# EAGLE design Tx (EAGLE 8.1.1)
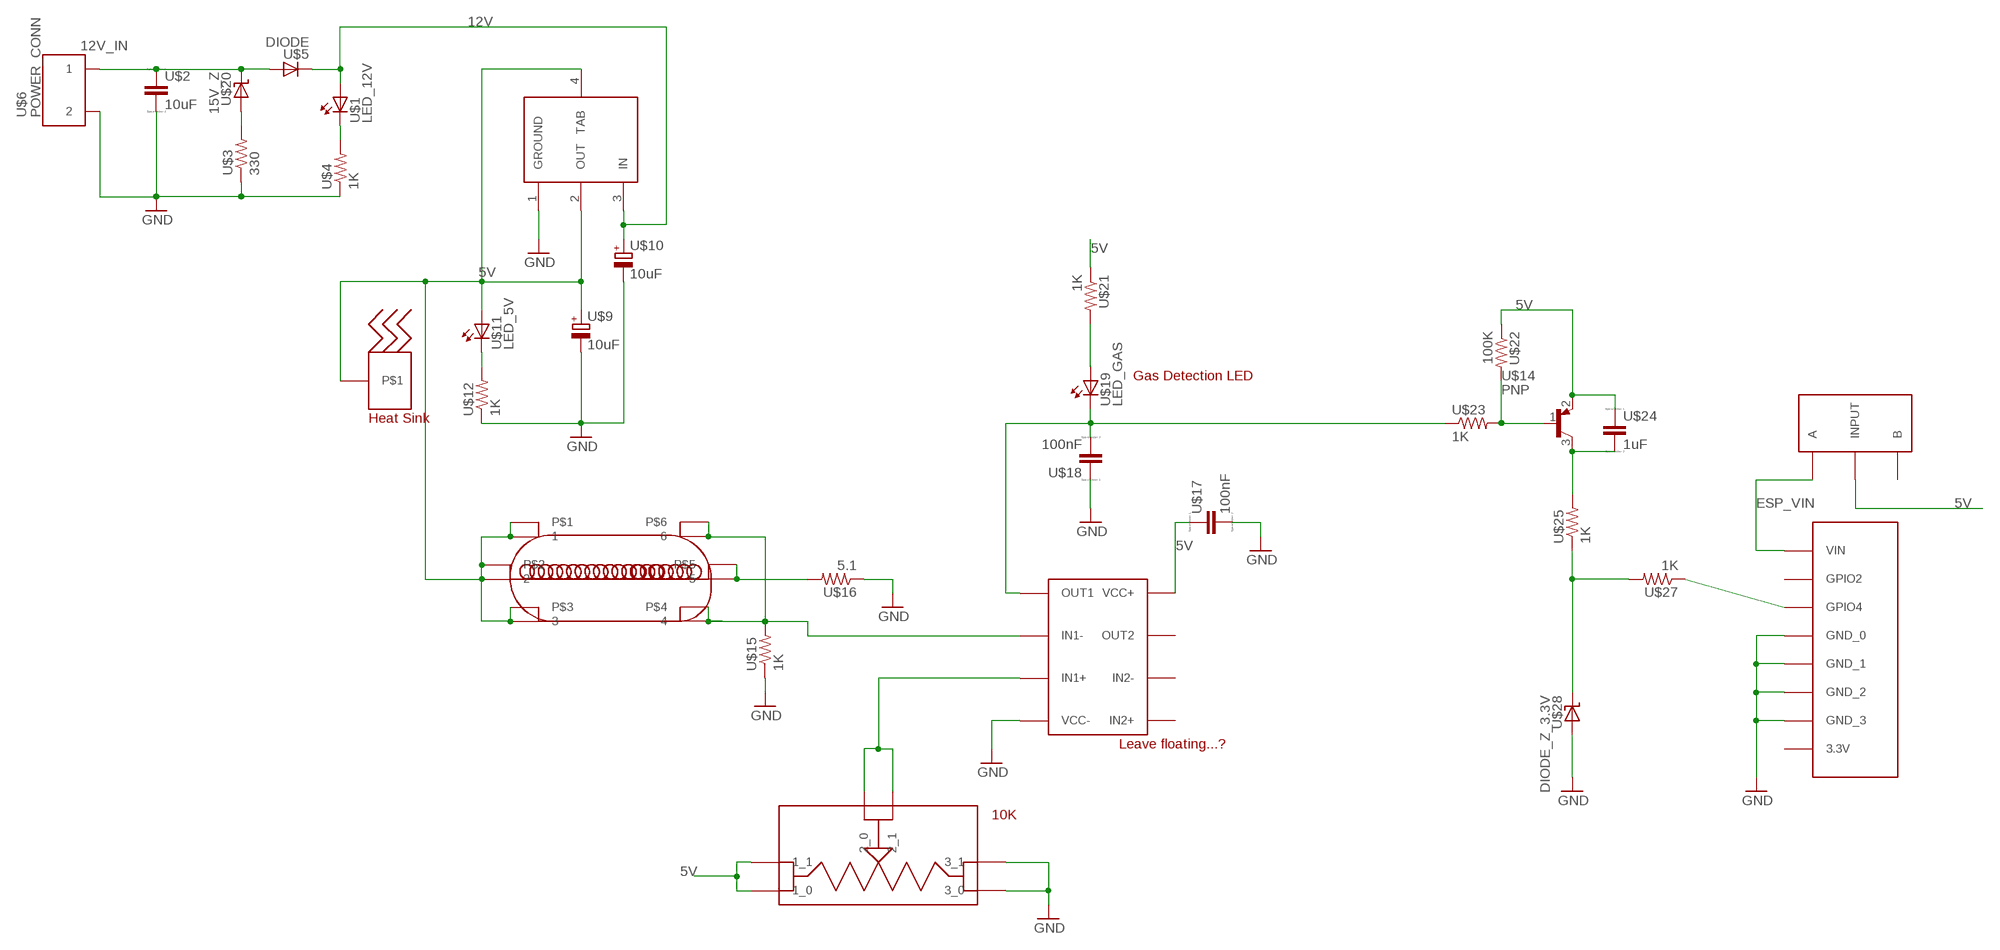
[diagram p0: schematic, sheet 1]

## Parts
U$1  LED_12V  LED_1206  [LED_1206]
U$2  10uF  CAP  [C1206]
U$3  330  RES  [R1206]
U$4  1K  RES  [R1206]
U$5  DIODE  DIODE_1206  [DIDOE_1206]
U$6  POWER_CONN  [PC_1935161]
U$7  LM393  [SO8]
U$8  5V_REG  [SOT223]
U$9  10uF  CAP_POL  [153CLV-0405]
U$10  10uF  CAP_POL  [153CLV-0405]
U$11  LED_5V  LED_1206  [LED_1206]
U$12  1K  RES  [R1206]
U$13  MQ  [MQ_GAS]
U$14  PNP  [SOT23]
U$15  1K  RES  [R1206]
U$16  5.1  RES  [R1206]
U$17  100nF  CAP  [C1206]
U$18  100nF  CAP  [C1206]
U$19  LED_GAS  LED_1206  [LED_1206]
U$20  15V_Z  DIODE_Z_1005  [Z_1005]
U$21  1K  RES  [R1206]
U$22  100K  RES  [R1206]
U$23  1K  RES  [R1206]
U$24  1uF  CAP  [C1206]
U$25  1K  RES  [R1206]
U$27  1K  RES  [R1206]
U$28  DIODE_Z_3.3V  [SOD-323]
U$29  ESP8266  [ESP]
U$30  POTENTIOMETER  [POTENTIOMETER]
U$31  HEAT_SINK  [THERMAL]
U$32  SPDT  [SPDT]

## Nets
5V: U$7.8(VCC+) U$8.2(OUT) U$8.4(TAB) U$9.+ U$11.1(HI) U$13.1 U$13.2 U$13.3 U$13.7 U$13.8 U$13.9 U$14.2(E) U$17.1 U$21.1 U$22.1 U$24.1 U$30.1_0 U$30.1_1 U$31.P$1 U$32.IN(INPUT)
12V: U$1.1(HI) U$5.2(LO) U$8.3(IN) U$10.+
12V_IN: U$2.1 U$5.1(HI) U$6.1 U$20.2(LO)
ESP_VIN: U$29.VIN U$32.A
GND: U$2.2 U$3.1 U$4.1 U$6.2 U$7.4(VCC-) U$8.1(GROUND) U$9.- U$10.- U$12.1 U$15.1 U$16.1 U$17.2 U$18.1 U$28.P$1(HI) U$29.GND_0 U$29.GND_1 U$29.GND_2 U$29.GND_3 U$30.3_0 U$30.3_1
N$2: U$1.2(LO) U$4.2
N$3: U$11.2(LO) U$12.2
N$4: U$13.5 U$13.11 U$16.2
N$5: U$3.2 U$20.1(HI)
N$6: U$7.3(IN1+) U$30.2_0 U$30.2_1
N$7: U$7.1(OUT1) U$18.2 U$19.2(LO) U$23.1
N$8: U$14.1(B) U$22.2 U$23.2
N$9: U$19.1(HI) U$21.2
N$11: U$14.3(C) U$24.2 U$25.2
N$13: U$25.1 U$27.2 U$28.P$2(LO)
N$14: U$27.1 U$29.GPIO4
N$15: U$7.2(IN1-) U$13.4 U$13.6 U$13.10 U$13.12 U$15.2
Unconnected: U$7.5(IN2+) U$7.6(IN2-) U$7.7(OUT2) U$29.3.3_1(3.3V) U$29.GPIO2 U$32.B

## Notes on the sheet
- Gas Detection LED
- Leave floating...?
- 10K

## Library data of the parts
U$1 U$11 U$19 = Gas_Sensor_Lib_v1:LED_1206
U$2 U$17 U$18 U$24 = Gas_Sensor_Lib_v1:CAP
U$3 U$4 U$12 U$15 U$16 U$21-U$23 U$25 U$27 = Gas_Sensor_Lib_v1:RES
U$5 = Gas_Sensor_Lib_v1:DIODE_1206
U$6 = Gas_Sensor_Lib_v1:POWER_CONN
U$7 = Gas_Sensor_Lib_v1:LM393
U$8 = Gas_Sensor_Lib_v1:5V_REG
U$9 U$10 = Gas_Sensor_Lib_v1:CAP_POL
U$13 = Gas_Sensor_Lib_v1:MQ
U$14 = Gas_Sensor_Lib_v1:PNP
U$20 = Gas_Sensor_Lib_v1:DIODE_Z_1005
U$28 = Gas_Sensor_Lib_v1:DIODE_Z_3.3V
U$29 = Gas_Sensor_Lib_v1:ESP8266
U$30 = Gas_Sensor_Lib_v1:POTENTIOMETER
U$31 = Gas_Sensor_Lib_v1:HEAT_SINK
U$32 = Gas_Sensor_Lib_v1:SPDT

## Board
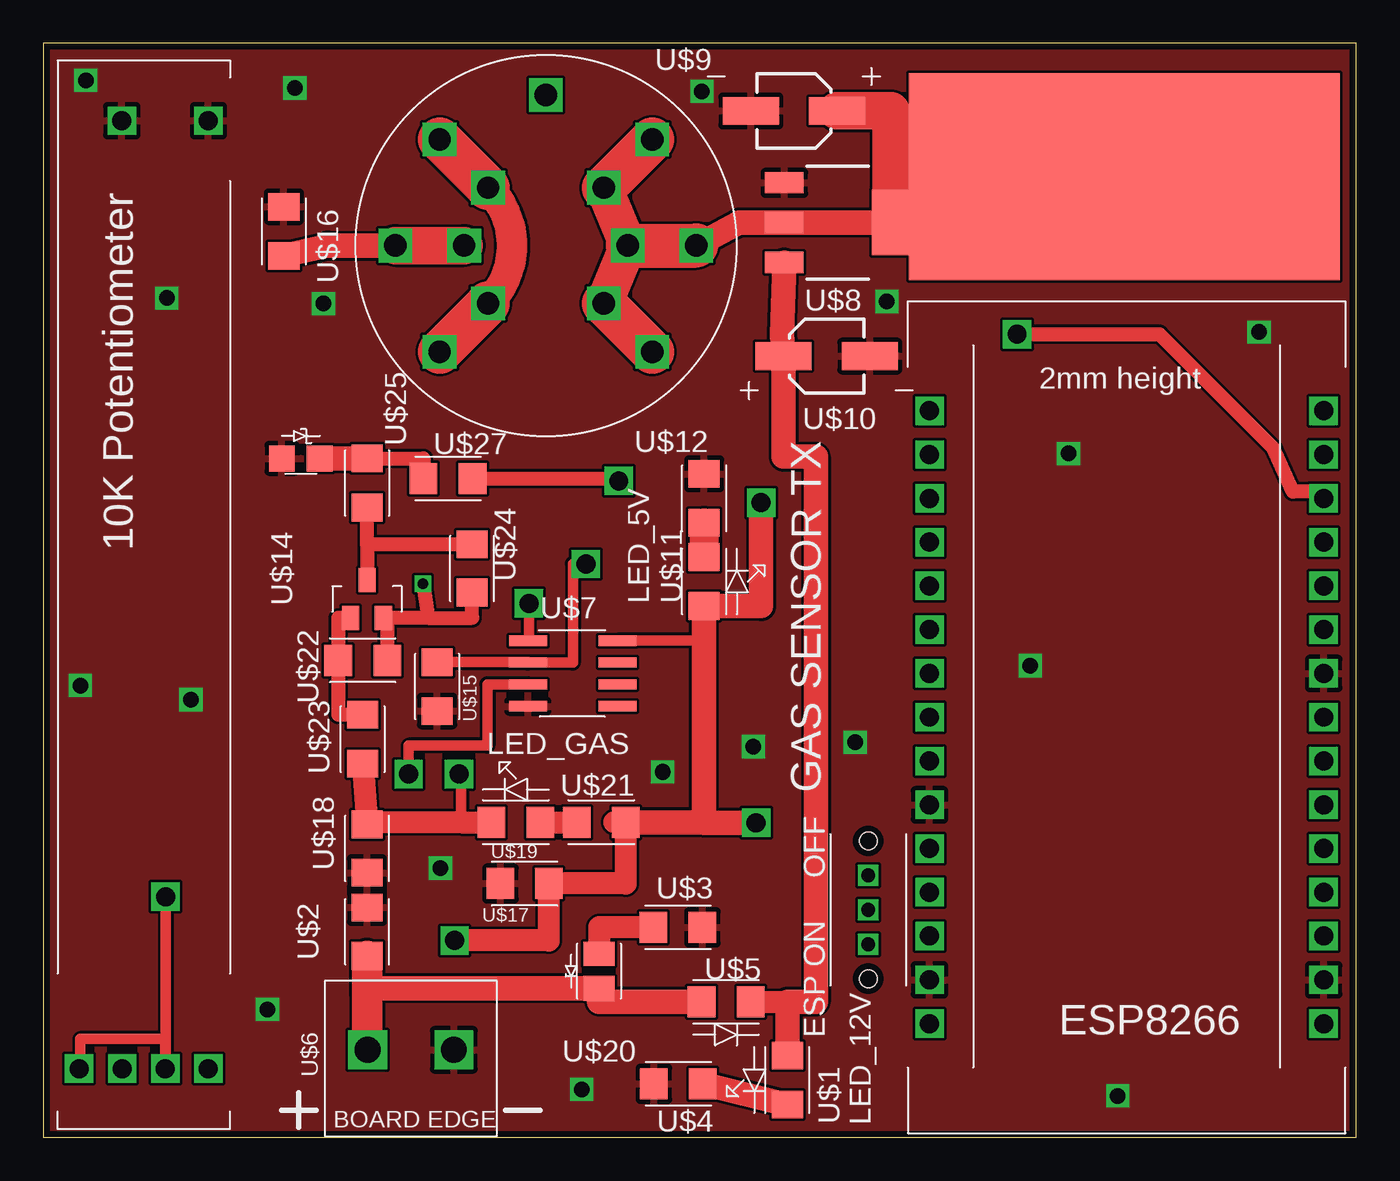
[diagram p1: board, top side]
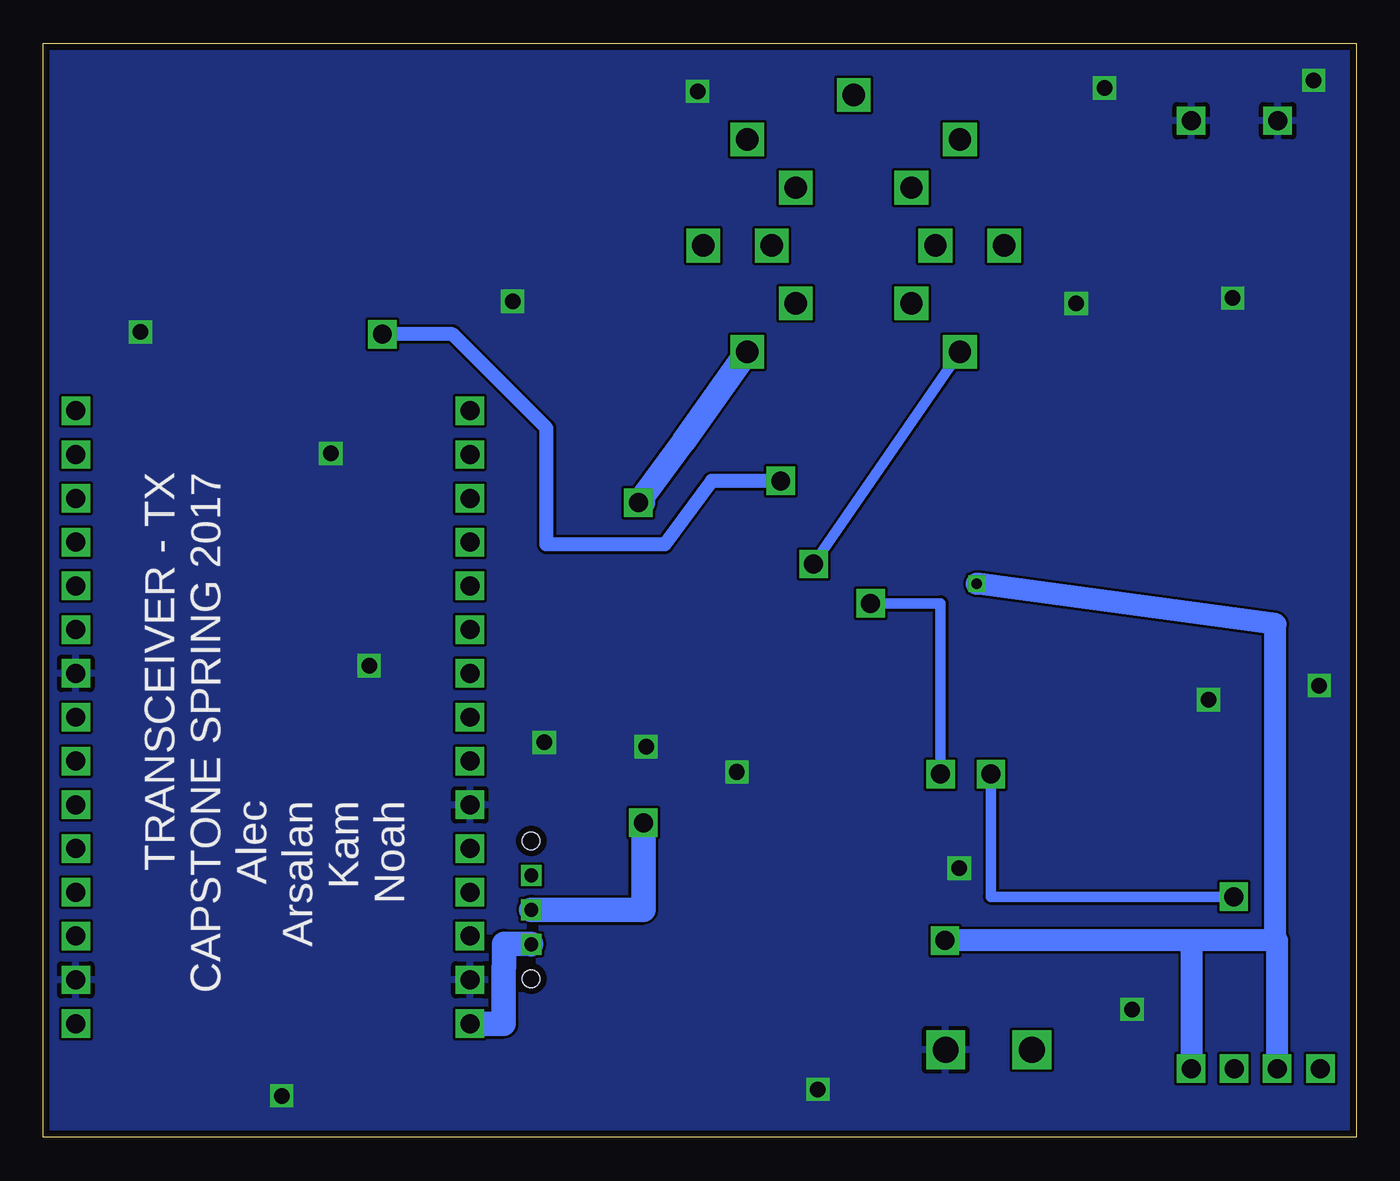
[diagram p2: board, bottom side, seen from below]

Size 76.2 x 63.5 mm. Coordinates in mm from the lower left corner, seen from the top.
Outline: 0,0 76.2,0 76.2,63.5 0,63.5 0,0
Copper layers (1*16): Top 0.0356mm / dielectric 1.5011mm / Bottom 0.0356mm
Design rules "oshpark-2layer": minimum track width 6mil, minimum drill 13mil, track to track 6mil, track to pad 6mil, pad to pad 6mil, via to via 6mil, smd to smd 6mil, copper to edge 15mil, drill to drill 6mil, minimum pad ring 7mil, minimum via ring 7mil, stop-mask expansion 2.5mil, vias tented up to drill 0mil, thermal gap 10mil

### Footprints (pad centres in the part's own frame; a part is rotated, then mirrored left to right if it is on the bottom)
LED_1206 = smd 1.6 x 1.803: 1 -1.422,0; 2 1.422,0
C1206 = smd 1.6 x 1.8: 1 -1.4,0; 2 1.4,0
R1206 = smd 1.6 x 1.803: 1 -1.422,0; 2 1.422,0
DIDOE_1206 = smd 1.6 x 1.803: 1 -1.422,0; 2 1.422,0
PC_1935161 = drill 1.5 square: 1 -2.5,0; 2 2.5,0
SO8 = smd 0.6 x 2.2: 1 -1.905,-2.6; 2 -0.635,-2.6; 3 0.635,-2.6; 4 1.905,-2.6; 5 1.905,2.6; 6 0.635,2.6; 7 -0.635,2.6; 8 -1.905,2.6
SOT223 = smd 1.219 x 2.235: 1 -2.311,-3.099; 2 0,-3.099; 3 2.311,-3.099 | smd 3.8 x 2.2: 4 0,3.099
153CLV-0405 = smd 3.25 x 1.6: + 2.5,0; - -2.5,0
MQ_GAS = drill 1.3 square: 1 -3.36,3.36; 2 -4.75,0; 3 -3.36,-3.36; 4 3.36,-3.36; 5 4.75,0; 6 3.36,3.36; 7 -6.17,6.17; 8 -8.73,0; 9 -6.17,-6.17; 10 6.17,-6.17; 11 8.73,0; 12 6.17,6.17; 13 0,-8.73
SOT23 = smd 1 x 1.4: 1 -0.95,-1.1; 2 0.95,-1.1; 3 0,1.1
Z_1005 = smd 1.4 x 1.8: 1 -1,0; 2 1,0
SOD-323 = smd 1.5 x 1.5: P$1 -1.1,0; P$2 1.1,0
ESP = drill 1.1 square: 3.3_0 11.43,5.08; 3.3_1 11.43,-17.78; 3.3_2 -11.43,-7.62; GND_0 -11.43,-15.24; GND_1 -11.43,-5.08; GND_2 11.43,2.54; GND_3 11.43,-15.24; GPIO2 11.43,7.62; GPIO4 11.43,12.7; P$2 -11.43,0; P$3 -11.43,2.54; P$4 -11.43,5.08; P$5 -11.43,7.62; P$6 -11.43,10.16; P$7 -11.43,12.7; P$8 -11.43,15.24; P$9 -11.43,17.78; P$10 11.43,0; P$14 11.43,10.16; P$16 11.43,15.24; P$17 11.43,17.78; P$19 -11.43,-12.7; P$20 -11.43,-10.16; P$23 -11.43,-2.54; P$26 11.43,-12.7; P$27 11.43,-10.16; P$28 11.43,-7.62; P$29 11.43,-5.08; P$30 11.43,-2.54; VIN -11.43,-17.78
POTENTIOMETER = drill 1.1 square: 1_0 -27.5,-3.75; 1_1 -27.5,1.25; 2_0 -27.5,-1.25; 2_1 -27.5,3.75; 3_0 27.5,-3.75; 3_1 27.5,1.27
THERMAL = smd 25 x 12: P$1 0,0
SPDT = drill 0.8 square: A -2,0; B 2,0; IN 0,0 | hole 1: -4,0; 4,0

### Placement (x,y rotation side)
U$1  43.18,3.33 270 top
U$2  18.8,11.94 90 top
U$3  36.83,12.19 180 top
U$4  36.86,3.11 0 top
U$5  39.62,7.87 0 top
U$6  21.34,5.08 0 top
U$7  30.73,26.92 270 top
U$8  46.1,53.09 270 top
U$9  43.56,59.56 0 top
U$10  45.47,45.34 180 top
U$11  38.35,32.26 90 top
U$12  38.35,37.08 270 top
U$13  29.18,51.75 180 top
U$14  18.8,31.24 0 top
U$15  22.86,26.16 90 top
U$16  13.97,52.58 270 top
U$17  27.94,14.73 180 top
U$18  18.8,16.76 90 top
U$19  27.43,18.29 180 top
U$20  32.26,9.65 270 top
U$21  32.38,18.29 180 top
U$22  18.54,27.69 180 top
U$23  18.54,23.11 90 top
U$24  24.89,33.02 90 top
U$25  18.8,37.97 270 top
U$27  23.5,38.23 180 top
U$28  14.95,39.4 0 top
U$29  62.87,24.38 0 top
U$30  5.84,31.5 90 top
U$31  62.74,55.75 0 top
U$32  47.88,13.21 90 top

### Tracks (layer width: path | path; a pad name or v marks a point on that pad's centre or on a via)
5V  (via drill 0.6, 1.1)
  Top 0.61: U$11.1 38.35,28.83 U$7.8
  Top 0.813: U$22.1 19.96,30.14 U$14.2 22.35,30.14 | U$24.1 24.89,30.14 22.35,30.14 | v22.04,32.13 22.35,30.14
  Top 1.27: 33.15,18.29 U$21.1 33.81,14.73 U$17.1 29.34,11.43 v23.88,11.43
  Top 1.422: v41.66,36.83 41.66,30.84 U$11.1 38.35,18.29 | U$8.4 U$8.2 40.39,53.09 U$13.8 | 38.35,18.29 U$21.1 | v41.37,18.26 38.35,18.26 38.35,18.29
  Top 1.778: U$8.4 59.44,53.09 59.44,52.96
  Top 2.184: U$13.3 U$13.2 U$13.1 | U$9.+ 49.2,59.56 U$8.4
  Top 2.54: U$13.7 U$13.1 | U$13.2 U$13.8 | U$13.9 U$13.3
  Top 3.81: 59.44,52.96 arc90 U$31.P$1
  Bottom 1.27: 9.59,11.43 v23.88,11.43 | 9.59,11.43 U$30.1_0 | U$30.1_1 4.59,11.43 4.7,11.43 | 4.7,11.43 9.59,11.43 | 4.7,11.43 4.7,29.78 v22.04,32.13
  Bottom 1.422: U$13.7 39.03,40.39 v41.66,36.83 41.4,36.83 | U$32.IN 41.37,13.21 v41.37,18.26
12V
  Top 1.27: U$5.2 44.32,7.87
  Top 1.422: U$8.3 42.88,46.57 U$10.+ 42.97,39.5 44.83,39.5 44.83,7.87 44.32,7.87 43.18,7.87 U$1.1
12V_IN
  Top 1.422: U$5.1 32.26,7.87 U$20.2 18.8,8.65 18.8,8.38
  Top 1.778: U$6.1 18.8,5.08 18.8,8.38 U$2.1
  Top 2.184: 18.8,5.08 U$6.1
ESP_VIN
  Top 1.422: 51.44,6.64 U$29.VIN
  Bottom 1.422: U$29.VIN 49.47,6.6 49.47,9.87 49.47,11.24 47.88,11.24 U$32.A
GND  (via drill 0.9)
  other vias: 59.5,39.69 70.55,46.74 57.28,27.37 62.36,2.41 31.24,2.79 13.02,7.43 2.16,26.23 8.57,25.4 7.18,48.7 14.61,60.9 48.96,48.51 16.26,48.39 47.12,22.92 41.21,22.67 38.23,60.71 35.94,21.21 23.05,15.62 2.48,61.34
  pour Top: 0,63.5 76.2,63.5 76.2,-0.25 0,0
  pour Bottom: 0,63.5 76.2,63.5 76.2,-0.25 0,0
N$2
  Top 1.422: U$1.2 U$4.2
N$3
  Top 1.676: U$12.2 U$11.2
N$4
  Top 1.422: U$16.2 16.54,51.75 U$13.11
  Top 2.184: U$13.11 U$13.5
N$5
  Top 1.27: U$3.2 32.26,12.19 U$20.1
N$6  (via drill 1.1)
  Top 0.61: U$7.3 25.78,26.29 25.78,22.73 21.21,22.73 v21.21,21.08 | v7.11,13.97 7.11,4 U$30.2_0 7.09,5.71 2.16,5.71 2.16,4 U$30.2_1
  Bottom 0.61: v21.21,21.08 21.21,13.97 v7.11,13.97
N$7  (via drill 1.1)
  Top 0.61: U$7.1 28.19,28.83 v28.19,30.99 | 23.98,21.08 v24.13,21.08 24.26,21.08 24.26,18.29
  Top 1.27: U$19.2 24.26,18.29 18.8,18.29 U$18.2 U$23.1
  Bottom 0.61: v28.19,30.99 24.13,30.99 v24.13,21.08
N$8
  Top 0.813: U$14.1 17.12,30.14 U$22.2 17.12,24.54 U$23.2
N$9
  Top 1.27: U$19.1 U$21.2
N$11
  Top 0.813: 18.8,34.42 U$25.2 | 18.8,34.42 U$14.3 | U$24.2 18.8,34.42
N$13
  Top 0.813: 19.02,39.4 U$25.1 22.07,39.4 U$27.2
  Top 1.422: U$25.1 U$28.P$2
N$14  (via drill 1.1)
  Top 0.813: U$27.1 33.4,38.23 v33.4,38.1 | v56.52,46.61 64.77,46.61 71.37,40.01 72.52,37.47 74.3,37.47 U$29.GPIO4
  Bottom 0.813: v33.4,38.1 37.41,38.1 40.13,34.42 46.99,34.42 46.99,41.15 52.45,46.61 v56.52,46.61
N$15  (via drill 1.1)
  Top 0.61: U$15.2 28.13,27.58 U$7.2 30.73,27.56 30.73,33.27 v31.5,33.27
  Top 1.778: U$13.4 arc-90 U$13.6
  Top 2.54: U$13.10 U$13.4 | U$13.6 U$13.12
  Bottom 0.61: U$13.12 31.52,33.27 v31.5,33.27

### Text on the board
tPlace: 10K Potentiometer | LED_5V | LED_GAS | GAS SENSOR TX | ESP8266 | LED_12V
bPlace: TRANSCEIVER - TX / CAPSTONE SPRING 2017 | Alec / Arsalan / Kam / Noah